# EAGLE schematic 4bit Logic Unit (EAGLE 9.2.0)
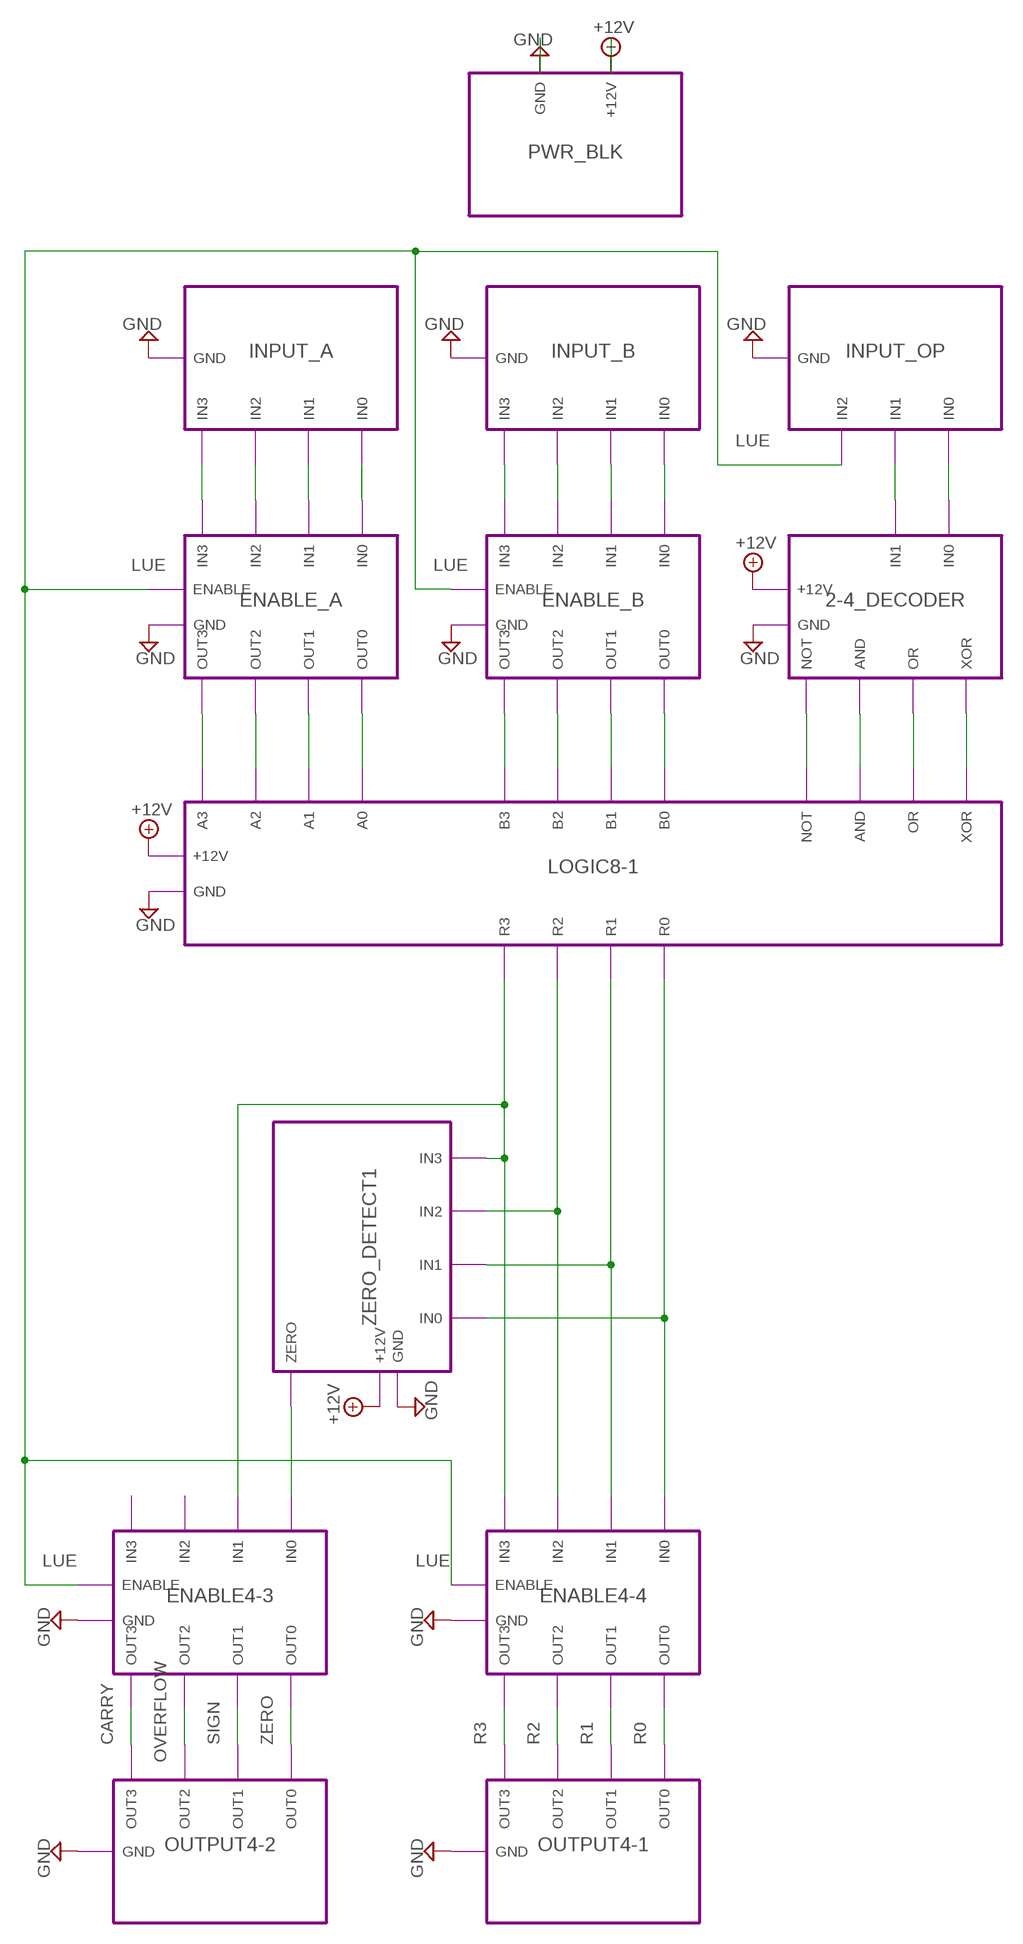
[diagram p0: schematic, sheet 1]

## Module instances
PWR_BLK = PWR_BLK
INPUT_A = INPUT4
INPUT_B = INPUT4
INPUT_OP = INPUT3
ENABLE_A = ENABLE4
ENABLE_B = ENABLE4
ZERO_DETECT1 = ZERO_DETECT
OUTPUT4-1 = OUTPUT4
OUTPUT4-2 = OUTPUT4
ENABLE4-3 = ENABLE4
ENABLE4-4 = ENABLE4
2-4_DECODER = 2-4_DECODER
LOGIC8-1 = LOGIC8

## Nets
+12V: port PWR_BLK.+12V 2-4_DECODER.+12V ZERO_DETECT1.+12V LOGIC8-1.+12V
CARRY: port ENABLE4-3.OUT3 OUTPUT4-2.OUT3
GND: port PWR_BLK.GND INPUT_A.GND INPUT_B.GND INPUT_OP.GND ENABLE_B.GND ENABLE_A.GND OUTPUT4-1.GND OUTPUT4-2.GND ENABLE4-3.GND ENABLE4-4.GND 2-4_DECODER.GND ZERO_DETECT1.GND LOGIC8-1.GND
LUE: port ENABLE_B.ENABLE ENABLE_A.ENABLE ENABLE4-3.ENABLE ENABLE4-4.ENABLE INPUT_OP.IN2
N$1: port INPUT_A.IN0 ENABLE_A.IN0
N$2: port INPUT_A.IN1 ENABLE_A.IN1
N$3: port INPUT_A.IN2 ENABLE_A.IN2
N$4: port INPUT_A.IN3 ENABLE_A.IN3
N$5: port INPUT_B.IN0 ENABLE_B.IN0
N$6: port INPUT_B.IN1 ENABLE_B.IN1
N$7: port INPUT_B.IN2 ENABLE_B.IN2
N$8: port INPUT_B.IN3 ENABLE_B.IN3
N$9: port ENABLE_B.OUT3 LOGIC8-1.B3
N$10: port ENABLE_B.OUT2 LOGIC8-1.B2
N$11: port ENABLE_B.OUT1 LOGIC8-1.B1
N$12: port ENABLE_B.OUT0 LOGIC8-1.B0
N$13: port INPUT_OP.IN0 2-4_DECODER.IN0
N$14: port ENABLE_A.OUT3 LOGIC8-1.A3
N$15: port ENABLE_A.OUT2 LOGIC8-1.A2
N$16: port ENABLE_A.OUT1 LOGIC8-1.A1
N$17: port ENABLE_A.OUT0 LOGIC8-1.A0
N$18: port INPUT_OP.IN1 2-4_DECODER.IN1
N$19: port 2-4_DECODER.NOT LOGIC8-1.NOT
N$20: port 2-4_DECODER.AND LOGIC8-1.AND
N$21: port 2-4_DECODER.OR LOGIC8-1.OR
N$22: port 2-4_DECODER.XOR LOGIC8-1.XOR
N$26: port ZERO_DETECT1.ZERO ENABLE4-3.IN0
N$40: port ZERO_DETECT1.IN0 ENABLE4-4.IN0 LOGIC8-1.R0
N$41: port ZERO_DETECT1.IN1 ENABLE4-4.IN1 LOGIC8-1.R1
N$42: port ZERO_DETECT1.IN2 ENABLE4-4.IN2 LOGIC8-1.R2
N$43: port ZERO_DETECT1.IN3 ENABLE4-3.IN1 ENABLE4-4.IN3 LOGIC8-1.R3
OVERFLOW: port ENABLE4-3.OUT2 OUTPUT4-2.OUT2
R0: port ENABLE4-4.OUT0 OUTPUT4-1.OUT0
R1: port ENABLE4-4.OUT1 OUTPUT4-1.OUT1
R2: port ENABLE4-4.OUT2 OUTPUT4-1.OUT2
R3: port ENABLE4-4.OUT3 OUTPUT4-1.OUT3
SIGN: port ENABLE4-3.OUT1 OUTPUT4-2.OUT1
ZERO: port ENABLE4-3.OUT0 OUTPUT4-2.OUT0

## Library data of the parts

## Module PWR_BLK
Ports: +12V(pwr) GND(pwr)
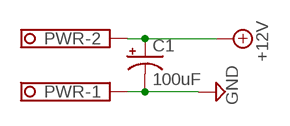
[diagram p1: schematic, module PWR_BLK, sheet 1]

### Parts
C1  100uF  100UF-POLAR-RADIAL-5MM-50V-20%  [CPOL-RADIAL-5MM-8MM]
PWR  PWR_BLK  [1751248]

### Nets
+12V: C1.1(+) PWR.2
GND: C1.2(-) PWR.1

### Library data of the parts
C1 = relay_computer_custom:100UF-POLAR: 100µF polarized capacitors A capacitor is a passive two-terminal electrical component used to store electrical energy temporarily in an electric field.; PROD_ID: ECA1HM101
PWR = relay_computer_custom:PWR_BLK: MKDS 1/ 2-3,5 Printklemme Nennstrom: 10 A Bemessungsspannung: 160 V Raster: 3,5 mm Polzahl: 2 Montageart: Löten Anschlussart: Schraubanschluss Anschlussrichtung vom Leiter zur Platine: 0° Source: http://eshop.phoenixcontact.com .. 1751248.pdf; OC_FARNELL: unknown; OC_NEWARK: unknown

## Module INPUT4
Ports: IN3(out) IN2(out) IN1(out) IN0(out) GND(pwr)
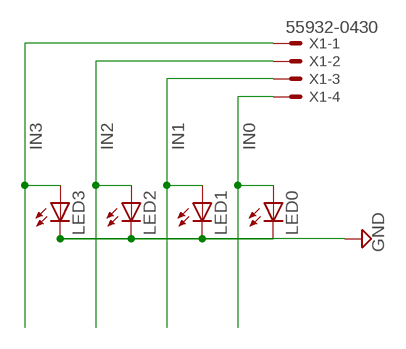
[diagram p2: schematic, module INPUT4, sheet 1]

### Parts
LED0  LED3MM  [LED3MM]
LED1  LED3MM  [LED3MM]
LED2  LED3MM  [LED3MM]
LED3  LED3MM  [LED3MM]
X1  55932-0430  [55932-0430]

### Nets
GND: LED0.K(C) LED1.K(C) LED2.K(C) LED3.K(C)
IN0: LED0.A X1.4
IN1: LED1.A X1.3
IN2: LED2.A X1.2
IN3: LED3.A X1.1

### Library data of the parts
LED0 LED1-LED3 = relay_computer_custom:LED: VCC 12V LED w/ built-in resistor
X1 = relay_computer_custom:55932-0430: 4 pin- 2.00mm Pitch MicroClasp™ Wire-to-Board Header, Single Row, Vertical, without PCB Locator Source: http://www.molex.com/pdm_docs/sd/559320430_sd.pdf

## Module INPUT3
Ports: IN0(out) IN1(out) IN2(out) GND(pwr)
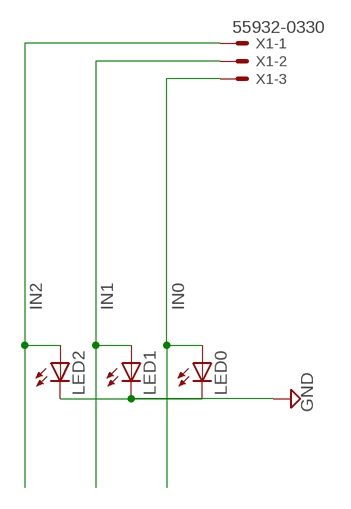
[diagram p3: schematic, module INPUT3, sheet 1]

### Parts
LED0  LED3MM  [LED3MM]
LED1  LED3MM  [LED3MM]
LED2  LED3MM  [LED3MM]
X1  55932-0330  [55932-0330]

### Nets
GND: LED0.K(C) LED1.K(C) LED2.K(C)
IN0: LED0.A X1.3
IN1: LED1.A X1.2
IN2: LED2.A X1.1

### Library data of the parts
LED0 LED1 LED2 = relay_computer_custom:LED: VCC 12V LED w/ built-in resistor
X1 = relay_computer_custom:55932-0330: 3 pin- 2.00mm Pitch MicroClasp™ Wire-to-Board Header, Single Row, Vertical, without PCB Locator Source: http://www.molex.com/pdm_docs/sd/559320330_sd.pdf

## Module ENABLE4
Ports: GND(pwr) ENABLE(in) OUT3(out) OUT2(out) OUT1(out) OUT0(out) IN3(in) IN2(in) IN1(in) IN0(in)
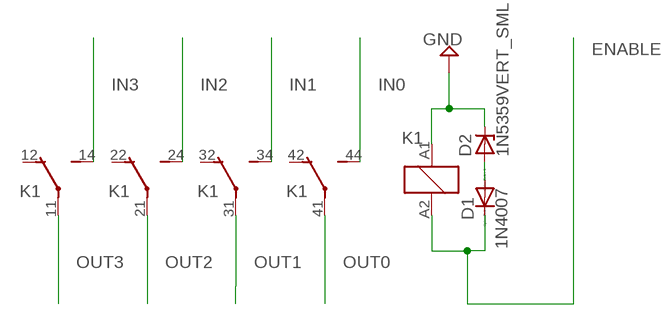
[diagram p4: schematic, module ENABLE4, sheet 1]

### Parts
D1  1N4007  [RAD2,5]
D2  1N5359VERT_SML  [RAD2.5_D2]
K1  PY14-02  [PY14-02]

### Nets
D$1: D1.A D2.A
ENABLE: D1.C K1.A2
GND: D2.C K1.A1
IN0: K1.44(5:S)
IN1: K1.34(4:S)
IN2: K1.24(3:S)
IN3: K1.14(2:S)
OUT0: K1.41(5:P)
OUT1: K1.31(4:P)
OUT2: K1.21(3:P)
OUT3: K1.11(2:P)
Unconnected: K1.12(2:O) K1.22(3:O) K1.32(4:O) K1.42(5:O)

### Library data of the parts
D1 = relay_computer_custom:1N4007: DIODE general purpose rectifier, 1 A
D2 = relay_computer_custom:1N5359: Z DIODE 24 V, 5W
K1 = relay_computer_custom:PY14-02: Miniature Relay OMRON 12VDC 4PDT 3A Relay Relay: MY4DC12 https://octopart.com/my4dc12-omron-13160135 Socket: PY14-02 https://octopart.com/py14-02-omron-113738

## Module ZERO_DETECT
Ports: IN3(in) IN2(in) IN1(in) IN0(in) ZERO(out) +12V(pwr) GND(pwr)
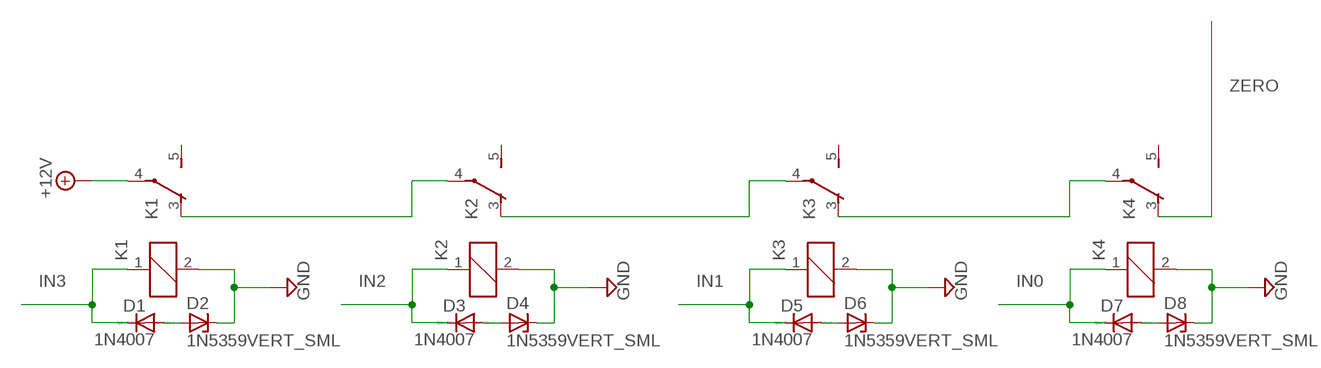
[diagram p5: schematic, module ZERO_DETECT, sheet 1]

### Parts
D1  1N4007  [RAD2,5]
D2  1N5359VERT_SML  [RAD2.5_D2]
D3  1N4007  [RAD2,5]
D4  1N5359VERT_SML  [RAD2.5_D2]
D5  1N4007  [RAD2,5]
D6  1N5359VERT_SML  [RAD2.5_D2]
D7  1N4007  [RAD2,5]
D8  1N5359VERT_SML  [RAD2.5_D2]
K1  HF41F-12-Z  [HF41F-12-Z]
K2  HF41F-12-Z  [HF41F-12-Z]
K3  HF41F-12-Z  [HF41F-12-Z]
K4  HF41F-12-Z  [HF41F-12-Z]

### Nets
+12V: K1.4(2:P)
D$1: D1.A D2.A
D$2: D3.A D4.A
D$3: D5.A D6.A
D$4: D7.A D8.A
GND: D2.C D4.C D6.C D8.C K1.2 K2.2 K3.2 K4.2
IN0: D7.C K4.1
IN1: D5.C K3.1
IN2: D3.C K2.1
IN3: D1.C K1.1
N$2: K1.3(2:O) K2.4(2:P)
N$3: K2.3(2:O) K3.4(2:P)
N$4: K3.3(2:O) K4.4(2:P)
ZERO: K4.3(2:O)
Unconnected: K1.5(2:S) K2.5(2:S) K3.5(2:S) K4.5(2:S)

### Library data of the parts
D1 D3 D5 D7 = relay_computer_custom:1N4007: DIODE general purpose rectifier, 1 A
D2 D4 D6 D8 = relay_computer_custom:1N5359: Z DIODE 24 V, 5W
K1-K4 = relay_computer_custom:HF41F-12-Z: SPDT RELAY Relay SPDT 5mm x 28mm HONGFA

## Module OUTPUT4
Ports: OUT3(in) OUT2(in) OUT1(in) OUT0(in) GND(pwr)
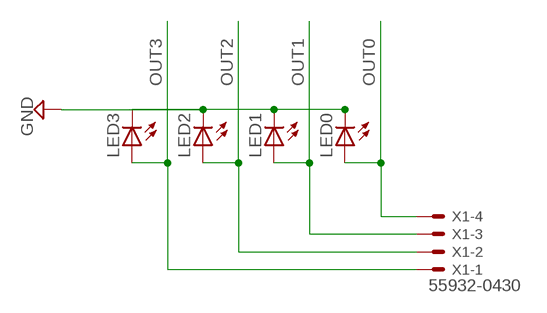
[diagram p6: schematic, module OUTPUT4, sheet 1]

### Parts
LED0  LED3MM  [LED3MM]
LED1  LED3MM  [LED3MM]
LED2  LED3MM  [LED3MM]
LED3  LED3MM  [LED3MM]
X1  55932-0430  [55932-0430]

### Nets
GND: LED0.K(C) LED1.K(C) LED2.K(C) LED3.K(C)
OUT0: LED0.A X1.4
OUT1: LED1.A X1.3
OUT2: LED2.A X1.2
OUT3: LED3.A X1.1

### Library data of the parts
LED0 LED1-LED3 = relay_computer_custom:LED: VCC 12V LED w/ built-in resistor
X1 = relay_computer_custom:55932-0430: 4 pin- 2.00mm Pitch MicroClasp™ Wire-to-Board Header, Single Row, Vertical, without PCB Locator Source: http://www.molex.com/pdm_docs/sd/559320430_sd.pdf

## Module 2-4_DECODER
Ports: NOT(out) AND(out) OR(out) XOR(out) IN0(in) IN1(in) +12V(pwr) GND(pwr)
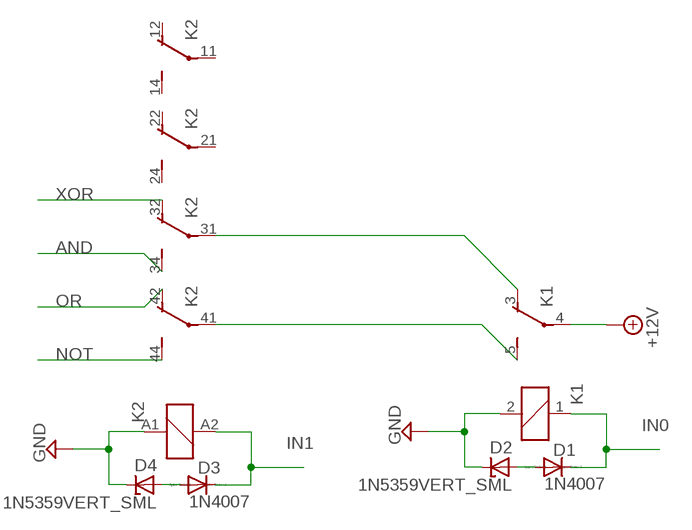
[diagram p7: schematic, module 2-4_DECODER, sheet 1]

### Parts
D1  1N4007  [RAD2,5]
D2  1N5359VERT_SML  [RAD2.5_D2]
D3  1N4007  [RAD2,5]
D4  1N5359VERT_SML  [RAD2.5_D2]
K1  HF41F-12-Z  [HF41F-12-Z]
K2  PY14-02  [PY14-02]

### Nets
+12V: K1.4(2:P)
AND: K2.34(4:S)
D$1: D1.A D2.A
D$2: D3.A D4.A
GND: D2.C D4.C K1.2 K2.A1
IN0: D1.C K1.1
IN1: D3.C K2.A2
N$1: K1.5(2:S) K2.41(5:P)
N$2: K1.3(2:O) K2.31(4:P)
NOT: K2.44(5:S)
OR: K2.42(5:O)
XOR: K2.32(4:O)
Unconnected: K2.11(2:P) K2.12(2:O) K2.14(2:S) K2.21(3:P) K2.22(3:O) K2.24(3:S)

### Library data of the parts
D1 D3 = relay_computer_custom:1N4007: DIODE general purpose rectifier, 1 A
D2 D4 = relay_computer_custom:1N5359: Z DIODE 24 V, 5W
K1 = relay_computer_custom:HF41F-12-Z: SPDT RELAY Relay SPDT 5mm x 28mm HONGFA
K2 = relay_computer_custom:PY14-02: Miniature Relay OMRON 12VDC 4PDT 3A Relay Relay: MY4DC12 https://octopart.com/my4dc12-omron-13160135 Socket: PY14-02 https://octopart.com/py14-02-omron-113738

## Module LOGIC1
Ports: NOT(out) AND(out) OR(out) XOR(out) A(in) B(in) GND(pwr) +12V(pwr)
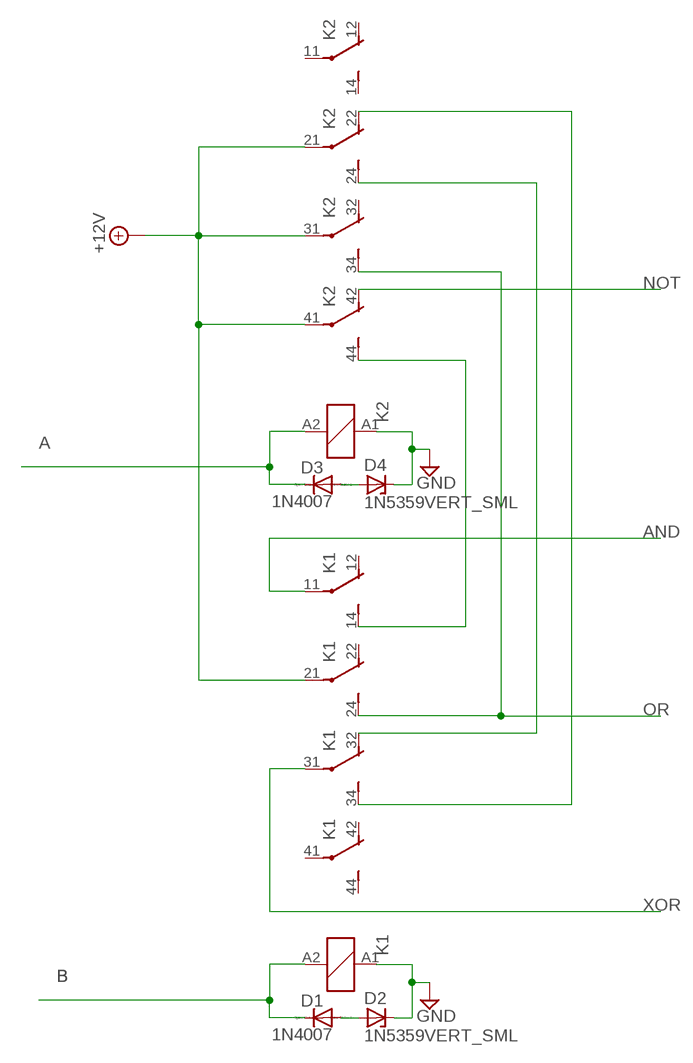
[diagram p8: schematic, module LOGIC1, sheet 1]

### Parts
D1  1N4007  [RAD2,5]
D2  1N5359VERT_SML  [RAD2.5_D2]
D3  1N4007  [RAD2,5]
D4  1N5359VERT_SML  [RAD2.5_D2]
K1  PY14-02  [PY14-02]
K2  PY14-02  [PY14-02]

### Nets
+12V: K1.21(3:P) K2.21(3:P) K2.31(4:P) K2.41(5:P)
A: D3.C K2.A2
AND: K1.11(2:P)
B: D1.C K1.A2
D$1: D1.A D2.A
D$2: D3.A D4.A
GND: D2.C D4.C K1.A1 K2.A1
N$1: K1.14(2:S) K2.44(5:S)
N$3: K1.32(4:O) K2.24(3:S)
N$4: K1.34(4:S) K2.22(3:O)
NOT: K2.42(5:O)
OR: K1.24(3:S) K2.34(4:S)
XOR: K1.31(4:P)
Unconnected: K1.12(2:O) K1.22(3:O) K1.41(5:P) K1.42(5:O) K1.44(5:S) K2.11(2:P) K2.12(2:O) K2.14(2:S) K2.32(4:O)

### Library data of the parts
D1 D3 = relay_computer_custom:1N4007: DIODE general purpose rectifier, 1 A
D2 D4 = relay_computer_custom:1N5359: Z DIODE 24 V, 5W
K1 K2 = relay_computer_custom:PY14-02: Miniature Relay OMRON 12VDC 4PDT 3A Relay Relay: MY4DC12 https://octopart.com/my4dc12-omron-13160135 Socket: PY14-02 https://octopart.com/py14-02-omron-113738

## Module LOGIC8
Ports: A3(in) A2(in) A1(in) A0(in) B3(in) B2(in) B1(in) B0(in) NOT(in) AND(in) OR(in) XOR(in) R3(io) R2(io) R1(io) R0(io) GND(pwr) +12V(pwr)
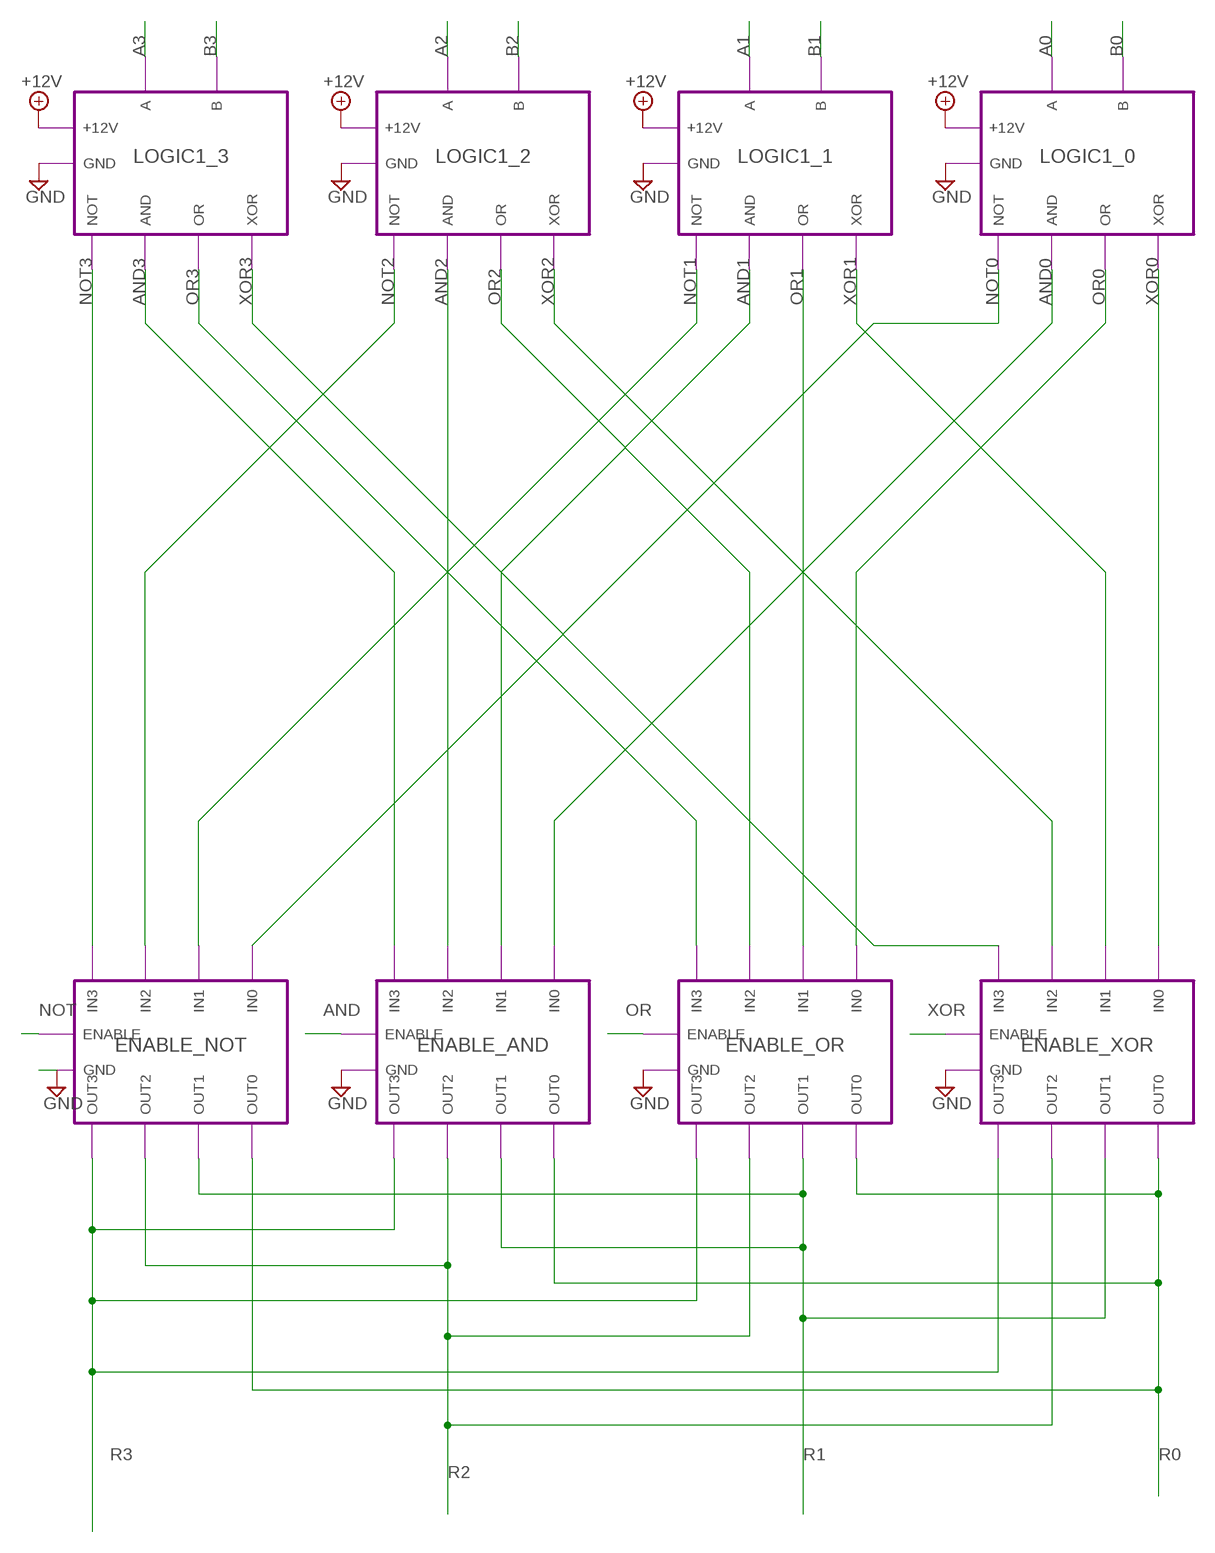
[diagram p9: schematic, module LOGIC8, sheet 1]

### Module instances
ENABLE_XOR = ENABLE4
ENABLE_OR = ENABLE4
ENABLE_AND = ENABLE4
ENABLE_NOT = ENABLE4
LOGIC1_0 = LOGIC1
LOGIC1_1 = LOGIC1
LOGIC1_2 = LOGIC1
LOGIC1_3 = LOGIC1

### Nets
+12V: port LOGIC1_0.+12V LOGIC1_1.+12V LOGIC1_2.+12V LOGIC1_3.+12V
A0: port LOGIC1_0.A
A1: port LOGIC1_1.A
A2: port LOGIC1_2.A
A3: port LOGIC1_3.A
AND: port ENABLE_AND.ENABLE
AND0: port LOGIC1_0.AND ENABLE_AND.IN0
AND1: port LOGIC1_1.AND ENABLE_AND.IN1
AND2: port LOGIC1_2.AND ENABLE_AND.IN2
AND3: port LOGIC1_3.AND ENABLE_AND.IN3
B0: port LOGIC1_0.B
B1: port LOGIC1_1.B
B2: port LOGIC1_2.B
B3: port LOGIC1_3.B
GND: port ENABLE_XOR.GND ENABLE_OR.GND ENABLE_AND.GND ENABLE_NOT.GND LOGIC1_0.GND LOGIC1_1.GND LOGIC1_2.GND LOGIC1_3.GND
NOT: port ENABLE_NOT.ENABLE
NOT0: port LOGIC1_0.NOT ENABLE_NOT.IN0
NOT1: port LOGIC1_1.NOT ENABLE_NOT.IN1
NOT2: port LOGIC1_2.NOT ENABLE_NOT.IN2
NOT3: port LOGIC1_3.NOT ENABLE_NOT.IN3
OR: port ENABLE_OR.ENABLE
OR0: port LOGIC1_0.OR ENABLE_OR.IN0
OR1: port LOGIC1_1.OR ENABLE_OR.IN1
OR2: port LOGIC1_2.OR ENABLE_OR.IN2
OR3: port LOGIC1_3.OR ENABLE_OR.IN3
R0: port ENABLE_XOR.OUT0 ENABLE_OR.OUT0 ENABLE_AND.OUT0 ENABLE_NOT.OUT0
R1: port ENABLE_OR.OUT1 ENABLE_NOT.OUT1 ENABLE_AND.OUT1 ENABLE_XOR.OUT1
R2: port ENABLE_AND.OUT2 ENABLE_NOT.OUT2 ENABLE_XOR.OUT2 ENABLE_OR.OUT2
R3: port ENABLE_NOT.OUT3 ENABLE_AND.OUT3 ENABLE_OR.OUT3 ENABLE_XOR.OUT3
XOR: port ENABLE_XOR.ENABLE
XOR0: port LOGIC1_0.XOR ENABLE_XOR.IN0
XOR1: port LOGIC1_1.XOR ENABLE_XOR.IN1
XOR2: port LOGIC1_2.XOR ENABLE_XOR.IN2
XOR3: port LOGIC1_3.XOR ENABLE_XOR.IN3

### Library data of the parts

## Net classes
0 default: width 0.508 mm